# Altium schematic sheet 3V3SwitchingRegulator.SchDoc: 3.3V Switching Regulator
size A4; Organization: UNSW Solar Racing Team; Address3: UNSW; Address4: Sydney NSW 2052; Address2: Electrical Engineering; Address1: Rm 109
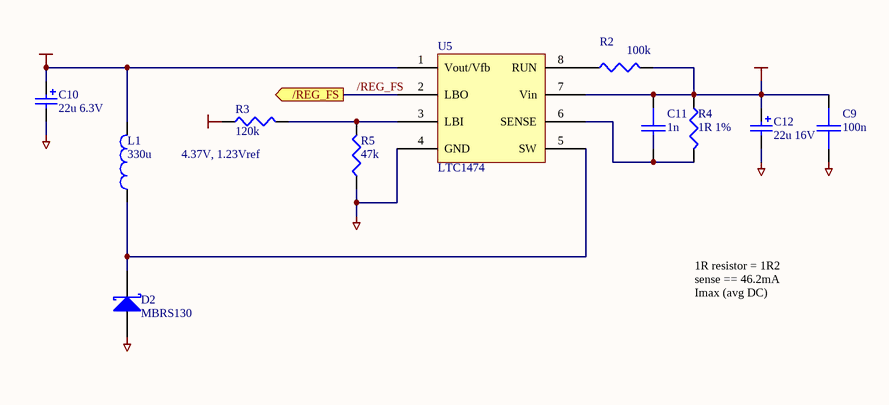
[diagram p0: 3V3SwitchingRegulator.SchDoc]

## Parts
C9  100n  [0603]
C10  22u 6.3V  [MCCT-CASEC]
C11  1n  [0603]
C12  22u 16V  [MCCT-CASEC]
D2  MBRS130  [SMB]
L1  330u  [1812]
R2  100k  [0603]
R3  120k  [0603]
R4  1R 1%  [0603]
R5  47k  [0603]
U5  LTC1474  [TSOP8]

## Ports
/REG_FS (out)

## Nets
3V3: C10.1 L1.2 U5.1(Vout/Vfb)
5V: C9.1 C11.1 C12.1 R2.2 R3.1 R4.1 U5.7(Vin)
GND: C9.2 C10.2 C12.2 D2.A R5.1 U5.4(GND)
/REG_FS: U5.2(LBO) ; port /REG_FS
NetC11_2: C11.2 R4.2 U5.6(SENSE)
NetD2_K: D2.K L1.1 U5.5(SW)
NetR2_1: R2.1 U5.8(RUN)
NetR3_2: R3.2 R5.2 U5.3(LBI)

## Notes on the sheet
- (near R3) 4.37V, 1.23Vref
- 1R resistor = 1R2 sense == 46.2mA Imax (avg DC)
- Title
- Size:
- Date:
- A4
- Number:
- Time:
- Revision:
- Sheet
- of
- File:

## Library data of the parts
C9 = CAP: Capacitor; Manufacturer: Generic Components; Class I: Passive; Value: 0.1uF; Published: 8-Jun-2000; Revision: July-2002: Re-released for DXP Platform.; Publisher: Altium Limited; Class II: Capacitor; Farnell: 753-567; Price: 0.30
C10 C12 = Cap Pol3: Polarized Capacitor (Surface Mount); Manufacturer: Generic Components; Class I: Passive; Value: 22uF; Published: 8-Jun-2000; Revision: July-2002: Re-released for DXP Platform.; Publisher: Altium Limited; Class II: Capacitor; Price: 2.14
  C10: Farnell: 967-026
  C12: Farnell: 967-129
C11 = CAP: Capacitor; Manufacturer: Generic Components; Class I: Passive; Value: 1nF; Published: 8-Jun-2000; Revision: July-2002: Re-released for DXP Platform.; Publisher: Altium Limited; Class II: Capacitor; Farnell: 753-580; Price: 0.13
D2 = D SCHOTTKY: Schottky Diode; Manufacturer: Generic Components; Class I: Discrete; Class II: Diode - Schottky; Published: 8-Jun-2000; Revision: July-2002: Re-released for DXP Platform.; Publisher: Altium Limited; Farnell: 708-150; Price: 1.47
L1 = Inductor: Manufacturer: Generic Components; Class I: Passive; Value: 330uH; Published: 8-Jun-2000; Revision: July-2002: Re-released for DXP Platform.; Publisher: Altium Limited; Class II: Inductor; Farnell: 200-451; Price: 3.02
R2 R5 = RES1: Resistor
  R2: Farnell: 612-728; Price: 0.11
  R5: Farnell: 360-2771; Price: 0.15
R3 = Res1: Resistor; Farnell: 3602825; Price: 0.15
R4 = RES1: Resistor; Manufacturer: Generic Components; Class I: Passive; Published: 8-Jun-2000; Revision: July-2002: Re-released for DXP Platform.; Publisher: Altium Limited; Class II: Resistor; Value: 1R; Farnell: 360-2217; Price: 0.15
U5 = LTC1474: Step-down converter, LTC1474CMS8-3.3; Order: Order from LTC website (4.60USD); Farnell: NA